# Altium project stmf417 board.PrjPcb (part 3 of 4)

## Sheet RS422.SchDoc
size A3; SheetNumber: 4; SheetTotal: 15
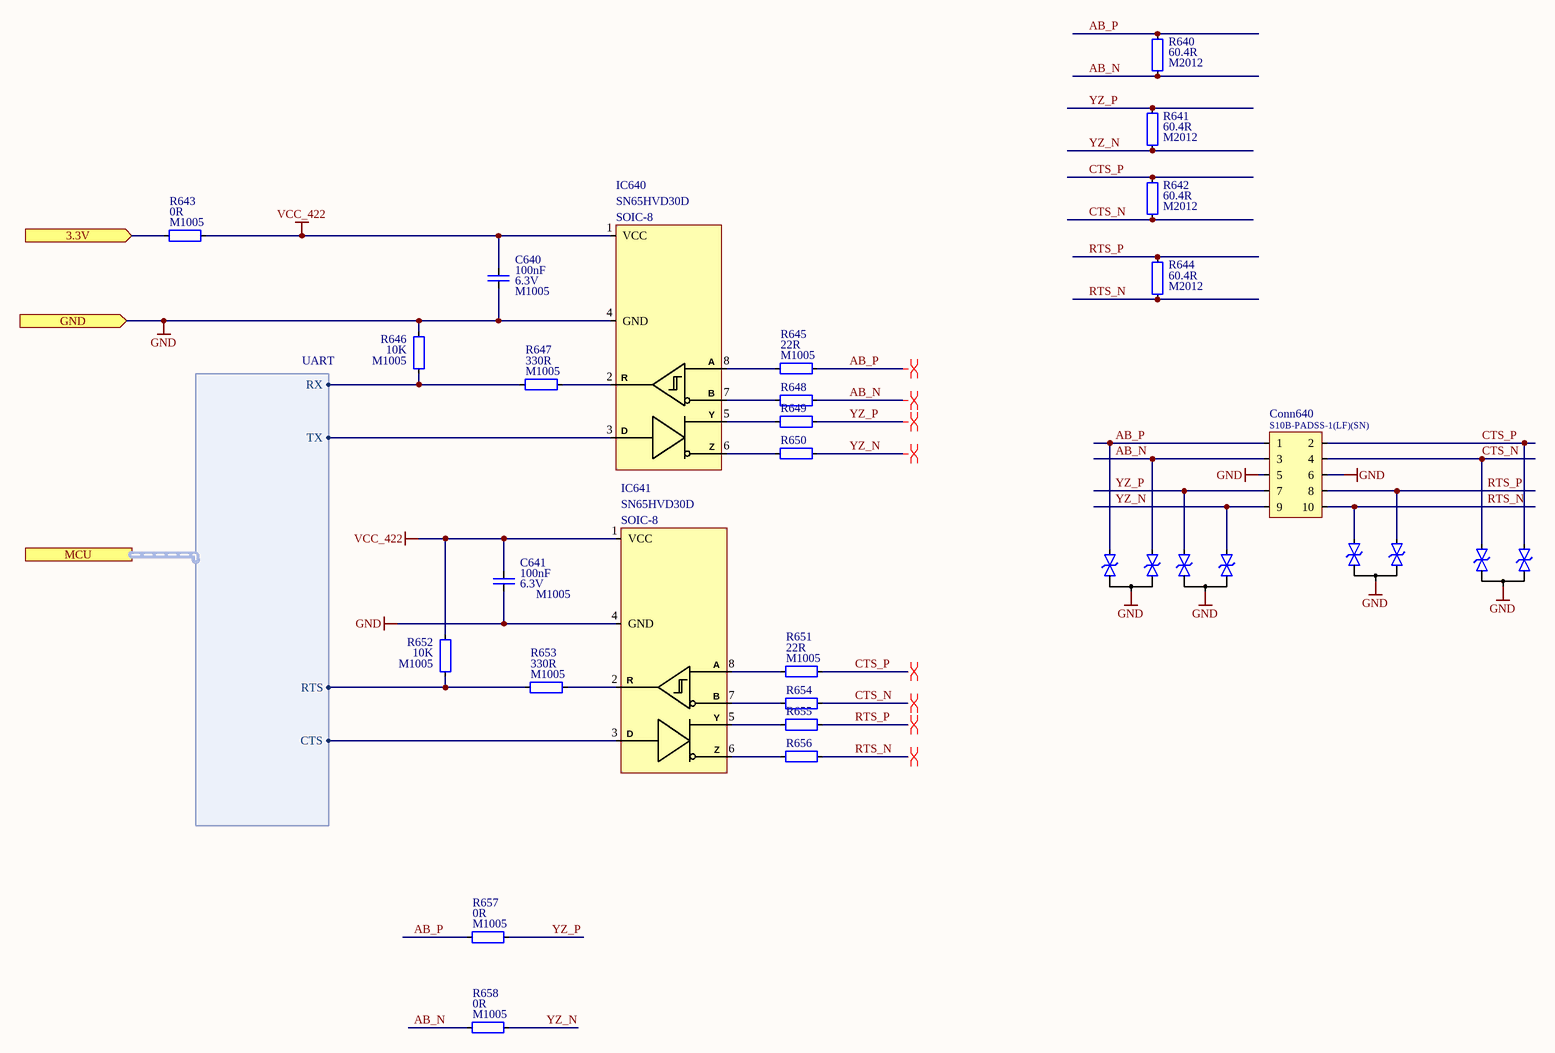
[diagram p7: RS422.SchDoc]

### Parts
C640  value 100nF  Voltage: 6.3V  Package: M1005  [Capacitor_Ceramic_M1005_I0402]  (hidden comment: Capacitor_Ceramic)
C641  value 100nF  Voltage: 6.3V  Package: M1005  [Capacitor_Ceramic_M1005_I0402]  (hidden comment: Capacitor_Ceramic)
Conn640  Manufacturer Part Number: S10B-PADSS-1(LF)(SN)  [Connector, S10B-PADSS-1]  (hidden comment: Connector - 10P)
IC640  Manufacturer Part Number: SN65HVD30D  Package: SOIC-8  [SOIC-8, NB]  (hidden comment: RS422 - Texas, SN65HVD30D)
IC641  Manufacturer Part Number: SN65HVD30D  Package: SOIC-8  [SOIC-8, NB]  (hidden comment: RS422 - Texas, SN65HVD30D)
R640  value 60.4R  Package: M2012  [Resistor_Smd_M2012_I0805]  (hidden comment: Resistor)
R641  value 60.4R  Package: M2012  [Resistor_Smd_M2012_I0805]  (hidden comment: Resistor)
R642  value 60.4R  Package: M2012  [Resistor_Smd_M2012_I0805]  (hidden comment: Resistor)
R643  value 0R  Package: M1005  [Resistor_Smd_M1005_I0402]  (hidden comment: Resistor)
R644  value 60.4R  Package: M2012  [Resistor_Smd_M2012_I0805]  (hidden comment: Resistor)
R645  value 22R  Package: M1005  [Resistor_Smd_M1005_I0402]  (hidden comment: Resistor)
R646  value 10K  Package: M1005  [Resistor_Smd_M1005_I0402]  (hidden comment: Resistor)
R647  value 330R  Package: M1005  [Resistor_Smd_M1005_I0402]  (hidden comment: Resistor)
R648  Resistor  [Resistor_Smd_M1005_I0402]  (value not drawn)
R649  Resistor  [Resistor_Smd_M1005_I0402]  (value not drawn)
R650  Resistor  [Resistor_Smd_M1005_I0402]  (value not drawn)
R651  value 22R  Package: M1005  [Resistor_Smd_M1005_I0402]  (hidden comment: Resistor)
R652  value 10K  Package: M1005  [Resistor_Smd_M1005_I0402]  (hidden comment: Resistor)
R653  value 330R  Package: M1005  [Resistor_Smd_M1005_I0402]  (hidden comment: Resistor)
R654  Resistor  [Resistor_Smd_M1005_I0402]  (value not drawn)
R655  Resistor  [Resistor_Smd_M1005_I0402]  (value not drawn)
R656  Resistor  [Resistor_Smd_M1005_I0402]  (value not drawn)
R657  value 0R  Package: M1005  [Resistor_Smd_M1005_I0402]  (hidden comment: Resistor)
R658  value 0R  Package: M1005  [Resistor_Smd_M1005_I0402]  (hidden comment: Resistor)
TVS640  Diode_Tvs_2P_Bidirectional  [Diode_SOT-23-3_2P_Bidirectional_Type_1]  (value not drawn)
TVS641  Diode_Tvs_2P_Bidirectional  [Diode_SOT-23-3_2P_Bidirectional_Type_1]  (value not drawn)
TVS642  Diode_Tvs_2P_Bidirectional  [Diode_SOT-23-3_2P_Bidirectional_Type_1]  (value not drawn)
TVS643  Diode_Tvs_2P_Bidirectional  [Diode_SOT-23-3_2P_Bidirectional_Type_1]  (value not drawn)

### Ports
3.3V (in), GND (in), MCU (harness UART)

### Harnesses
UART: RX, TX, RTS, CTS

### Nets
3.3V: R643.1 ; port 3.3V
GND: C640.2 C641.2 Conn640.5 Conn640.6 IC640.4(GND) IC641.4(GND) R646.1 TVS640.Common TVS641.Common TVS642.Common TVS643.Common ; port GND
VCC_422: C640.1 C641.1 IC640.1(VCC) IC641.1(VCC) R643.2 R652.1
AB_N: Conn640.3 R640.2 R648.2 R658.1 TVS642.D2
AB_P: Conn640.1 R640.1 R645.2 R657.1 TVS642.D1
CTS_N: Conn640.4 R642.2 R654.2 TVS641.D1
CTS_P: Conn640.2 R642.1 R651.2 TVS641.D2
PA9: IC640.3(D) ; port MCU.TX
PA10: R646.2 R647.1 ; port MCU.RX
PA11: IC641.3(D) ; port MCU.CTS
PA12: R652.2 R653.1 ; port MCU.RTS
RTS_N: Conn640.10 R644.2 R656.2 TVS640.D1
RTS_P: Conn640.8 R644.1 R655.2 TVS640.D2
YZ_N: Conn640.9 R641.2 R650.2 R658.2 TVS643.D2
YZ_P: Conn640.7 R641.1 R649.2 R657.2 TVS643.D1
NetIC640_2: IC640.2(R) R647.2
NetIC640_5: IC640.5(Y) R649.1
NetIC640_6: IC640.6(Z) R650.1
NetIC640_7: IC640.7(B) R648.1
NetIC640_8: IC640.8(A) R645.1
NetIC641_2: IC641.2(R) R653.2
NetIC641_5: IC641.5(Y) R655.1
NetIC641_6: IC641.6(Z) R656.1
NetIC641_7: IC641.7(B) R654.1
NetIC641_8: IC641.8(A) R651.1

### Layout directives
differential pair: AB_N, AB_P, CTS_N, CTS_P, RTS_N, RTS_P, YZ_N, YZ_P

### Library data of the parts
C640 C641 = Capacitor_Ceramic: as C600 on sheet CAN; ComponentLink1Description: Datasheet; ComponentLink1URL: E:\Altium\Datasheets\Capacitor\Kyocera - X5R.pdf; ComponentLink2Description: Supplier Link; ComponentLink2URL: https://www.digikey.com/en/products/detail/kyocera-avx/04026D104KAT4A/8107673; Supplier: Digikey; Supplier Part Number: 478-11504-1-ND; Operating Temperature, Min: +85℃; Operating Temperature, Max: -55℃; Quantity, Min: 1; Quantity, Max: 250000; Price, Min: 0.1; Supplier Currency: $; Price, Max: 0.00189; Supplier Link: https://www.digikey.com/en/products/detail/kyocera-avx/04026D104KAT4A/8107673; Component Type: Ceramic; Component Category: Capacitor
Conn640 = Connector - 10P: Conn, JST, 10P, TH, PAD, Side Entry; ComponentLink1Description: Datasheet; ComponentLink1URL: E:\Altium\Datasheets\Connector - JST\PAD Family.pdf; ComponentLink2Description: Supplier Link; ComponentLink2URL: https://www.digikey.com/en/products/detail/jst-sales-america-inc/S10B-PADSS-1-LF-SN/1634773; Supplier: Digikey; Supplier Part Number: 455-2032-ND; Manufacturer: JST; Operating Temperature, Min: -25℃; Operating Temperature, Max: +85℃; Quantity, Min: 1; Quantity, Max: 10080; Price, Min: 0.65; Supplier Currency: $; Price, Max: 0.27565; Supplier Link: https://www.digikey.com/en/products/detail/jst-sales-america-inc/S10B-PADSS-1-LF-SN/1634773; Component Type: PCB; Component Category: Connector; Package: TH, 2 Rows, RA, Side Entry
IC640 IC641 = RS422 - Texas, SN65HVD30D: IC, Interface, RS422, SOIC-8; ComponentLink1Description: Datasheet; ComponentLink1URL: E:\Altium\Datasheets\IC - Interface\RS422 - Texas, SN65HVD3x.pdf; ComponentLink2Description: Supplier Link; ComponentLink2URL: https://www.digikey.com/en/products/detail/texas-instruments/SN65HVD30D/1574539; Supplier: Digikey; Supplier Part Number: 296-26346-5-ND; Manufacturer: Texas; Operating Temperature, Min: -55℃; Operating Temperature, Max: +85℃; Quantity, Min: 1; Quantity, Max: 1000; Price, Min: 5.44; Supplier Currency: $; Price, Max: 3.1008; Supplier Link: https://www.digikey.com/en/products/detail/texas-instruments/SN65HVD30D/1574539; Component Type: Interface; Component Category: IC
R640-R642 R644 = Resistor: Res, 60.4R, 1%, M1005; Manufacturer: Yageo; Manufacturer Part Number: RC0805FR-0760R4L; Component Category: Resistor; Component Type: Fixed Value; Tolerance: 1%; Supplier Link: https://www.digikey.com/en/products/detail/yageo/RC0805FR-0760R4L/728073; Supplier Currency: $; Price, Max: 0.00328; Price, Min: 0.1; Quantity, Max: 125000; Quantity, Min: 1; Operating Temperature, Max: -55℃; Operating Temperature, Min: +155℃; Supplier Part Number: 311-60.4CRCT-ND; Supplier: Digikey; ComponentLink1Description: Datasheet; ComponentLink1URL: E:\Altium\Datasheets\Resistor\Yageo - RC_L Series.pdf; ComponentLink2Description: Supplier Link; ComponentLink2URL: https://www.digikey.com/en/products/detail/yageo/RC0805FR-0760R4L/728073
R643 R657 R658 = Resistor: as R600 on sheet CAN; Component Category: Resistor; Component Type: Fixed Value; Tolerance: *; Supplier Link: https://www.digikey.com/en/products/detail/yageo/RC0402FR-070RL/2827570; Supplier Currency: $; Price, Max: 0.00109; Price, Min: 0.1; Quantity, Max: 50000; Quantity, Min: 1; Operating Temperature, Max: -55℃; Operating Temperature, Min: +155℃; Supplier Part Number: 311-0.0LRCT-ND; Supplier: Digikey; ComponentLink1Description: Datasheet; ComponentLink1URL: E:\Altium\Datasheets\Resistor\Yageo - RC_L Series.pdf; ComponentLink2Description: Supplier Link; ComponentLink2URL: https://www.digikey.com/en/products/detail/yageo/RC0402FR-070RL/2827570
R645 R648-R651 R654-R656 = Resistor: Res, 22R, 1%, M1005; Manufacturer: Yageo; Manufacturer Part Number: RC0402FR-0722RL; Component Category: Resistor; Component Type: Fixed Value; Tolerance: 1%; Supplier Link: https://www.digikey.com/en/products/detail/yageo/RC0402FR-0722RL/726562; Supplier Currency: $; Price, Max: 0.00129; Price, Min: 0.1; Quantity, Max: 100000; Quantity, Min: 1; Operating Temperature, Max: -55℃; Operating Temperature, Min: +155℃; Supplier Part Number: 311-22.0LRCT-ND; Supplier: Digikey; ComponentLink1Description: Datasheet; ComponentLink1URL: E:\Altium\Datasheets\Resistor\Yageo - RC_L Series.pdf; ComponentLink2Description: Supplier Link; ComponentLink2URL: https://www.digikey.com/en/products/detail/yageo/RC0402FR-0722RL/726562
  R648-R650 R654-R656: Value: 22R; Package: M1005
R646 R652 = Resistor: Res, 10K, 1%, M1005; Manufacturer: Yageo; Manufacturer Part Number: RC0402FR-0710KP; Component Category: Resistor; Component Type: Fixed Value; Tolerance: 1%; Supplier Link: https://www.digikey.com/en/products/detail/yageo/RC0402FR-0710KP/4935264; Supplier Currency: $; Price, Max: 0.00282; Price, Min: 0.1; Quantity, Max: 100000; Quantity, Min: 1; Operating Temperature, Max: -55℃; Operating Temperature, Min: +155℃; Supplier Part Number: YAG1249CT-ND; Supplier: Digikey; ComponentLink1Description: Datasheet; ComponentLink1URL: E:\Altium\Datasheets\Resistor\Yageo - RC_L Series.pdf; ComponentLink2Description: Supplier Link; ComponentLink2URL: https://www.digikey.com/en/products/detail/yageo/RC0402FR-0710KP/4935264
R647 R653 = Resistor: as R621 on sheet RS232; Component Category: Resistor; Component Type: Fixed Value; Tolerance: 1%; Supplier Link: https://www.digikey.com/en/products/detail/yageo/RC0402FR-07330RL/726594; Supplier Currency: $; Price, Max: 0.00129; Price, Min: 0.1; Quantity, Max: 100000; Quantity, Min: 1; Operating Temperature, Max: -55℃; Operating Temperature, Min: +155℃; Supplier Part Number: 311-330LRCT-ND; Supplier: Digikey; ComponentLink1Description: Datasheet; ComponentLink1URL: E:\Altium\Datasheets\Resistor\Yageo - RC_L Series.pdf; ComponentLink2Description: Supplier Link; ComponentLink2URL: https://www.digikey.com/en/products/detail/yageo/RC0402FR-07330RL/726594
TVS640-TVS643 = Diode_Tvs_2P_Bidirectional: TVS, 2P, Bidirectional, 7V/12V, SOT-23-3; Manufacturer Part Number: CDSOT23-SM712; Manufacturer: Bourns; Component Category: Diode; Voltage, Break Down: 7.5V...13.3V; Voltage, Stand Off: 7V...12V; ComponentLink1Description: Datasheet; ComponentLink1URL: E:\Altium\Datasheets\Diode\Bourns, CDSOT23-SM712.pdf; ComponentLink2Description: Supplier Link; ComponentLink2URL: https://www.digikey.com/en/products/detail/bourns-inc/CDSOT23-SM712/1630592; Supplier: Digikey; Supplier Part Number: CDSOT23-SM712CT-ND; Operating Temperature, Min: -55℃; Operating Temperature, Max: +150℃; Quantity, Min: 1; Quantity, Max: 3000; Price, Min: 1.59; Price, Max: 0.675; Supplier Currency: $; Supplier Link: https://www.digikey.com/en/products/detail/bourns-inc/CDSOT23-SM712/1630592; Component Type: TVS; Package: SOT-23-3

## Sheet FTDI.SchDoc
size A3; SheetNumber: 8; SheetTotal: 15
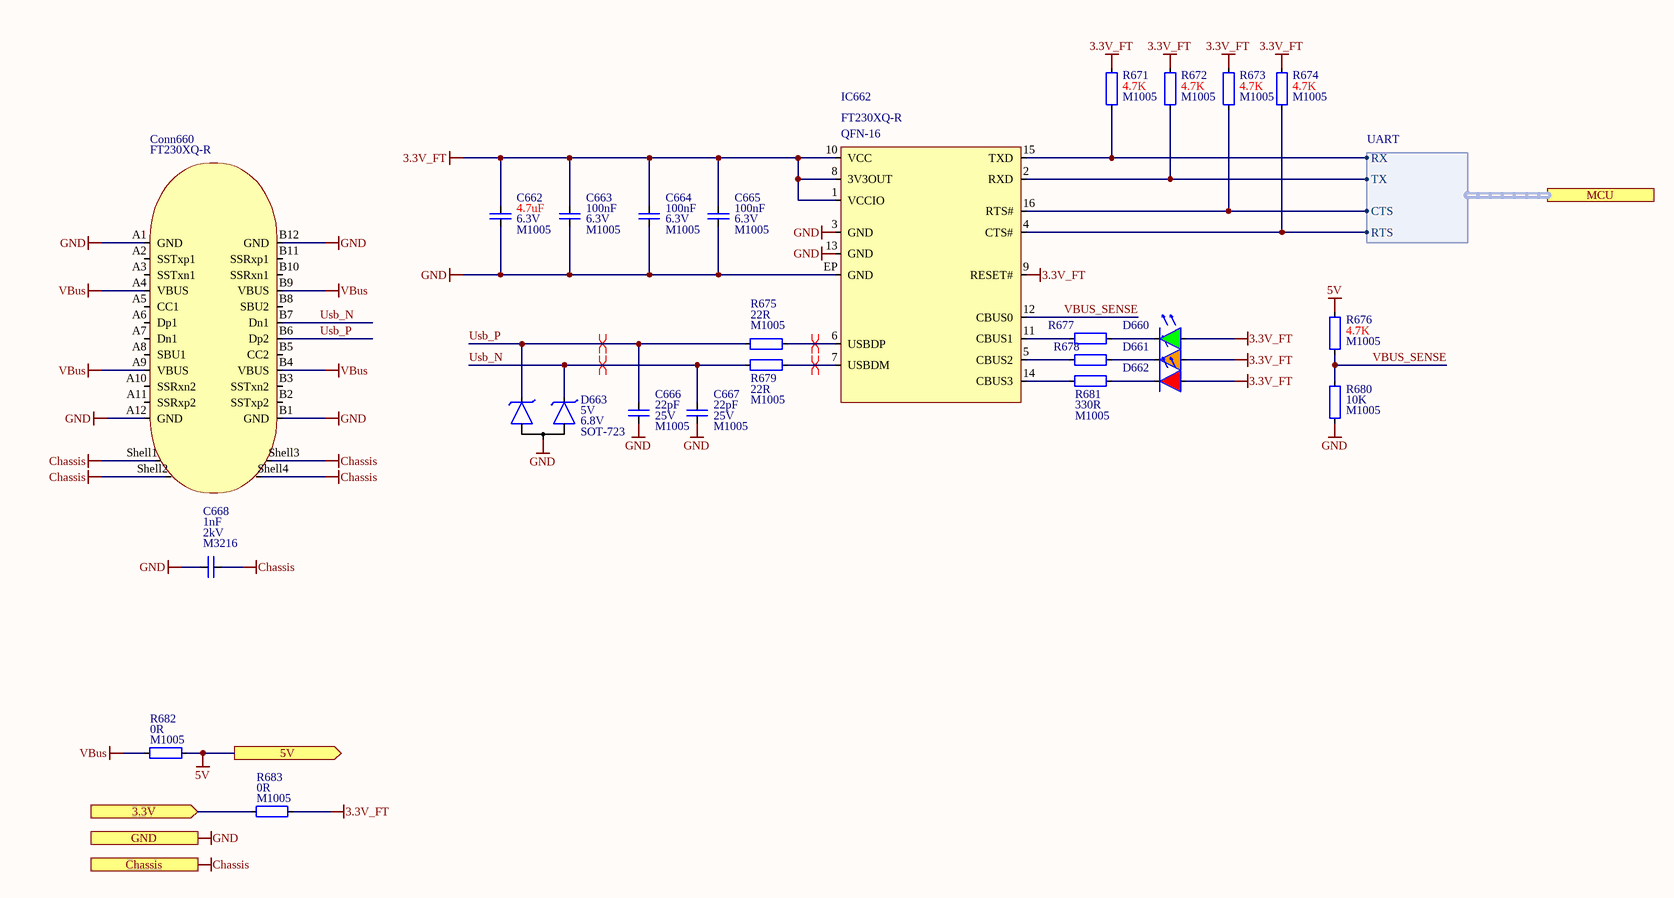
[diagram p8: FTDI.SchDoc]

### Parts
C662  value 4.7uF  Voltage: 6.3V  Package: M1005  [Capacitor_Ceramic_M1005_I0402]  (hidden comment: Capacitor_Ceramic)
C663  value 100nF  Voltage: 6.3V  Package: M1005  [Capacitor_Ceramic_M1005_I0402]  (hidden comment: Capacitor_Ceramic)
C664  value 100nF  Voltage: 6.3V  Package: M1005  [Capacitor_Ceramic_M1005_I0402]  (hidden comment: Capacitor_Ceramic)
C665  value 100nF  Voltage: 6.3V  Package: M1005  [Capacitor_Ceramic_M1005_I0402]  (hidden comment: Capacitor_Ceramic)
C666  value 22pF  Voltage: 25V  Package: M1005  [Capacitor_Ceramic_M1005_I0402]  (hidden comment: Capacitor_Ceramic)
C667  value 22pF  Voltage: 25V  Package: M1005  [Capacitor_Ceramic_M1005_I0402]  (hidden comment: Capacitor_Ceramic)
C668  value 1nF  Voltage: 2kV  Package: M3216  [Capacitor_Ceramic_M3216_I1206]  (hidden comment: Capacitor_Ceramic)
Conn660  Manufacturer Part number: FT230XQ-R  [GCT, USB4056]  (hidden comment: GCT, USB4056)
D660  Diode_Led  [Diode_Smd_M1608_I0603_Green-Yellow]  (value not drawn)
D661  Diode_Led  [Diode_Smd_M1608_I0603_Orange1]  (value not drawn)
D662  Diode_Led  [Diode_Smd_M1608_I0603_Red]  (value not drawn)
D663  Voltage, Break Down: 6.8V  Voltage, Stand Off: 5V  Package: SOT-723  [Diode_SOT-723_2P_Common_Anode_Type_1]  (hidden comment: Diode_Tvs_2P_Common_Anode)
IC662  Manufacturer Part number: FT230XQ-R  Package: QFN-16  [QFN-16, 4mm x 4mm, 0.65mm]  (hidden comment: FTDI_FT230XQ)
R671  value 4.7K  Package: M1005  [Resistor_Smd_M1005_I0402]  (hidden comment: Resistor)
R672  value 4.7K  Package: M1005  [Resistor_Smd_M1005_I0402]  (hidden comment: Resistor)
R673  value 4.7K  Package: M1005  [Resistor_Smd_M1005_I0402]  (hidden comment: Resistor)
R674  value 4.7K  Package: M1005  [Resistor_Smd_M1005_I0402]  (hidden comment: Resistor)
R675  value 22R  Package: M1005  [Resistor_Smd_M1005_I0402]  (hidden comment: Resistor)
R676  value 4.7K  Package: M1005  [Resistor_Smd_M1005_I0402]  (hidden comment: Resistor)
R677  Resistor  [Resistor_Smd_M1005_I0402]  (value not drawn)
R678  Resistor  [Resistor_Smd_M1005_I0402]  (value not drawn)
R679  value 22R  Package: M1005  [Resistor_Smd_M1005_I0402]  (hidden comment: Resistor)
R680  value 10K  Package: M1005  [Resistor_Smd_M1005_I0402]  (hidden comment: Resistor)
R681  value 330R  Package: M1005  [Resistor_Smd_M1005_I0402]  (hidden comment: Resistor)
R682  value 0R  Package: M1005  [Resistor_Smd_M1005_I0402]  (hidden comment: Resistor)
R683  value 0R  Package: M1005  [Resistor_Smd_M1005_I0402]  (hidden comment: Resistor)

### Ports
3.3V (in), 5V (out), Chassis (in), GND (in), MCU (harness UART)

### Harnesses
UART: RX, TX, RTS, CTS

### Nets
3.3V: R683.1 ; port 3.3V
3.3V_FT: C662.1 C663.1 C664.1 C665.1 D660.A D661.A D662.A IC662.1(VCCIO) IC662.8(3V3OUT) IC662.9(RESET#) IC662.10(VCC) R671.1 R672.1 R673.1 R674.1 R683.2
5V: R676.1 R682.2 ; port 5V
Chassis: C668.2 Conn660.Shell1(Chassis1) Conn660.Shell2(Chassis2) Conn660.Shell3(Chassis3) Conn660.Shell4(Chassis4) ; port Chassis
GND: C662.2 C663.2 C664.2 C665.2 C666.2 C667.2 C668.1 Conn660.A1(GND) Conn660.A12(GND) Conn660.B1(GND) Conn660.B12(GND) D663.A IC662.3(GND) IC662.13(GND) IC662.EP(GND) R680.2 ; port GND
VBus: Conn660.A4(VBUS) Conn660.A9(VBUS) Conn660.B4(VBUS) Conn660.B9(VBUS) R682.1
PB10: IC662.2(RXD) R672.2 ; port MCU.TX
PB14: IC662.4(CTS#) R674.2 ; port MCU.RTS
PD9: IC662.15(TXD) R671.2 ; port MCU.RX
PD11: IC662.16(RTS#) R673.2 ; port MCU.CTS
Usb_N: C667.1 Conn660.B7(Dn1) D663.C2 R679.1
Usb_P: C666.1 Conn660.B6(Dp2) D663.C1 R675.1
VBUS_SENSE: IC662.12(CBUS0) R676.2 R680.1
NetD660_C: D660.C R677.2
NetD661_C: D661.C R678.2
NetD662_C: D662.C R681.2
NetIC662_5: IC662.5(CBUS2) R678.1
NetIC662_6: IC662.6(USBDP) R675.2
NetIC662_7: IC662.7(USBDM) R679.2
NetIC662_11: IC662.11(CBUS1) R677.1
NetIC662_14: IC662.14(CBUS3) R681.1

Not connected (* = marked no-connect by the designer): Conn660 A2(SSTxp1) A3(SSTxn1) A5(CC1) A6(Dp1) A7(Dn1) A8(SBU1) A10(SSRxn2) A11(SSRxp2) B2(SSTxp2) B3(SSTxn2) B5(CC2) B8(SBU2) B10(SSRxn1) B11(SSRxp1)

### Layout directives
differential pair: NetIC662_6, NetIC662_7, Usb_N, Usb_P

### Library data of the parts
C662-C665 = Capacitor_Ceramic: as C600 on sheet CAN; ComponentLink1Description: Datasheet; ComponentLink1URL: E:\Altium\Datasheets\Capacitor\Kyocera - X5R.pdf; ComponentLink2Description: Supplier Link; ComponentLink2URL: https://www.digikey.com/en/products/detail/kyocera-avx/04026D104KAT4A/8107673; Supplier: Digikey; Supplier Part Number: 478-11504-1-ND; Operating Temperature, Min: +85℃; Operating Temperature, Max: -55℃; Quantity, Min: 1; Quantity, Max: 250000; Price, Min: 0.1; Supplier Currency: $; Price, Max: 0.00189; Supplier Link: https://www.digikey.com/en/products/detail/kyocera-avx/04026D104KAT4A/8107673; Component Type: Ceramic; Component Category: Capacitor
C666 C667 = Capacitor_Ceramic: Cap, Cer, 22pF, 25V, M1005; Manufacturer Part Number: 0402N220J250CT; Manufacturer: Walsin; Temperature Coefficient: C0G, NP0; Tolerance: 5%; ComponentLink1Description: Datasheet; ComponentLink1URL: E:\Altium\Datasheets\Capacitor\Walsin - Multilayer Ceramic Capacitors.pdf; ComponentLink2Description: Supplier Link; ComponentLink2URL: https://www.digikey.com/en/products/detail/walsin-technology-corporation/0402N220J250CT/9354779; Supplier: Digikey; Supplier Part Number: 1292-1282-1-ND; Operating Temperature, Min: +125℃; Operating Temperature, Max: -55℃; Quantity, Min: 1; Quantity, Max: 250000; Price, Min: 0.1; Supplier Currency: $; Price, Max: 0.00177; Supplier Link: https://www.digikey.com/en/products/detail/walsin-technology-corporation/0402N220J250CT/9354779; Component Type: Ceramic; Component Category: Capacitor
C668 = Capacitor_Ceramic: Cap, Cer, 1nF, 2kV, M3216; Manufacturer Part Number: CC1206MKX7RDBB102; Manufacturer: Yageo; Temperature Coefficient: X7R; Tolerance: 20%; ComponentLink1Description: Datasheet; ComponentLink1URL: E:\Altium\Datasheets\Capacitor\Yageo - Surface-Mount Ceramic Multilayer Capacitors.pdf; ComponentLink2Description: Supplier Link; ComponentLink2URL: https://www.digikey.com/en/products/detail/yageo/CC1206MKX7RDBB102/5884663; Supplier: Digikey; Supplier Part Number: 311-4501-1-ND; Operating Temperature, Min: +125℃; Operating Temperature, Max: -55℃; Quantity, Min: 1; Quantity, Max: 300000; Price, Min: 0.23; Supplier Currency: $; Price, Max: 0.03271; Supplier Link: https://www.digikey.com/en/products/detail/yageo/CC1206MKX7RDBB102/5884663; Component Type: Ceramic; Component Category: Capacitor
Conn660 = GCT, USB4056: IC,Interface,FTDI,QFN16; component category: capacitor*; ComponentLink1Description: datasheet; ComponentLink1URL: *; ComponentLink2Description: supplier link; ComponentLink2URL: *; component type: ceramic; supplier link: *; supplier currency: *; price,max: *; price,min: *; Quantity,max: *; Quantity,min: *; Operating Temparature,max: +85; Operating Temparature,min: -40; Supplier Part number: *; Supplier: Digikey; Manufacturer: FTDI; Package: SOP-8
D660 = Diode_Led: as D101 on sheet Power; ComponentLink1Description: Datasheet; ComponentLink1URL: E:\Altium\Datasheets\Diode\Rohm, SML-D12x1 Series.pdf; ComponentLink2Description: Supplier Link; ComponentLink2URL: https://www.digikey.com/en/products/detail/rohm-semiconductor/SML-D12M1WT86/5843856; Supplier: Digikey; Supplier Part Number: SML-D12M1WT86CT-ND; Operating Temperature, Min: -40℃; Operating Temperature, Max: +85℃; Quantity, Min: 1; Quantity, Max: 75000; Price, Min: 0.25; Price, Max: 0.02838; Supplier Currency: $; Supplier Link: https://www.digikey.com/en/products/detail/rohm-semiconductor/SML-D12M1WT86/5843856; Component Type: Led; Component Category: Diode; Current: 20mA; Voltage: 2.2V; Package: M1608
D661 = Diode_Led: as D740 on sheet Ethernet; ComponentLink1Description: Datasheet; ComponentLink1URL: E:\Altium\Datasheets\Diode\Rohm, SML-D12x1 Series.pdf; ComponentLink2Description: Supplier Link; ComponentLink2URL: https://www.digikey.com/en/products/detail/rohm-semiconductor/SML-D12D1WT86/5843854; Supplier: Digikey; Supplier Part Number: SML-D12D1WT86CT-ND; Operating Temperature, Min: -40℃; Operating Temperature, Max: +85℃; Quantity, Min: 1; Quantity, Max: 75000; Price, Min: 0.25; Price, Max: 0.02838; Supplier Currency: $; Supplier Link: https://www.digikey.com/en/products/detail/rohm-semiconductor/SML-D12D1WT86/5843854; Component Type: Led; Component Category: Diode; Current: 20mA; Voltage: 2.2V; Package: M1608
D662 = Diode_Led: Diode, Led, Red, 2.2V, 20mA, M1608; Manufacturer Part Number: SML-D12U1WT86; Manufacturer: Rohm; ComponentLink1Description: Datasheet; ComponentLink1URL: E:\Altium\Datasheets\Diode\Rohm, SML-D12x1 Series.pdf; ComponentLink2Description: Supplier Link; ComponentLink2URL: https://www.digikey.com/en/products/detail/rohm-semiconductor/SML-D12U1WT86/5843853; Supplier: Digikey; Supplier Part Number: SML-D12U1WT86CT-ND; Operating Temperature, Min: -40℃; Operating Temperature, Max: +85℃; Quantity, Min: 1; Quantity, Max: 75000; Price, Min: 0.25; Price, Max: 0.02838; Supplier Currency: $; Supplier Link: https://www.digikey.com/en/products/detail/rohm-semiconductor/SML-D12U1WT86/5843853; Component Type: Led; Component Category: Diode; Current: 20mA; Voltage: 2.2V; Package: M1608
D663 = Diode_Tvs_2P_Common_Anode: Diode, TVS, 5V/6.8V, SOD-723; Manufacturer Part Number: DF3A6.8LFV,L3F; Manufacturer: Toshiba; ComponentLink1Description: Datasheet; ComponentLink1URL: E:\Altium\Datasheets\Diode\Toshiba, DF3A6.8LFV.pdf; ComponentLink2Description: Supplier Link; ComponentLink2URL: https://www.digikey.com/en/products/detail/toshiba-semiconductor-and-storage/DF3A6-8LFV-L3F/4305070; Supplier: Digikey; Supplier Part Number: DF3A6.8LFVL3FCT-ND; Operating Temperature, Min: ---℃; Operating Temperature, Max: ---℃; Quantity, Min: 1; Quantity, Max: 200000; Price, Min: 0.25; Price, Max: 0.027; Supplier Currency: $; Supplier Link: https://www.digikey.com/en/products/detail/toshiba-semiconductor-and-storage/DF3A6-8LFV-L3F/4305070; Component Type: Tvs; Component Category: Diode
IC662 = FTDI_FT230XQ: IC,Interface,FTDI,QFN16; component category: capacitor*; ComponentLink1Description: datasheet; ComponentLink1URL: *; ComponentLink2Description: supplier link; ComponentLink2URL: *; component type: ceramic; supplier link: *; supplier currency: *; price,max: *; price,min: *; Quantity,max: *; Quantity,min: *; Operating Temparature,max: +85; Operating Temparature,min: -40; Supplier Part number: *; Supplier: Digikey; Manufacturer: FTDI
R671-R674 R676 R680 = Resistor: as R646 on sheet RS422; Component Category: Resistor; Component Type: Fixed Value; Tolerance: 1%; Supplier Link: https://www.digikey.com/en/products/detail/yageo/RC0402FR-0710KP/4935264; Supplier Currency: $; Price, Max: 0.00282; Price, Min: 0.1; Quantity, Max: 100000; Quantity, Min: 1; Operating Temperature, Max: -55℃; Operating Temperature, Min: +155℃; Supplier Part Number: YAG1249CT-ND; Supplier: Digikey; ComponentLink1Description: Datasheet; ComponentLink1URL: E:\Altium\Datasheets\Resistor\Yageo - RC_L Series.pdf; ComponentLink2Description: Supplier Link; ComponentLink2URL: https://www.digikey.com/en/products/detail/yageo/RC0402FR-0710KP/4935264
R675 R679 = Resistor: as R645 on sheet RS422; Component Category: Resistor; Component Type: Fixed Value; Tolerance: 1%; Supplier Link: https://www.digikey.com/en/products/detail/yageo/RC0402FR-0722RL/726562; Supplier Currency: $; Price, Max: 0.00129; Price, Min: 0.1; Quantity, Max: 100000; Quantity, Min: 1; Operating Temperature, Max: -55℃; Operating Temperature, Min: +155℃; Supplier Part Number: 311-22.0LRCT-ND; Supplier: Digikey; ComponentLink1Description: Datasheet; ComponentLink1URL: E:\Altium\Datasheets\Resistor\Yageo - RC_L Series.pdf; ComponentLink2Description: Supplier Link; ComponentLink2URL: https://www.digikey.com/en/products/detail/yageo/RC0402FR-0722RL/726562
R677 R678 R681 = Resistor: as R621 on sheet RS232; Component Category: Resistor; Component Type: Fixed Value; Tolerance: 1%; Supplier Link: https://www.digikey.com/en/products/detail/yageo/RC0402FR-07330RL/726594; Supplier Currency: $; Price, Max: 0.00129; Price, Min: 0.1; Quantity, Max: 100000; Quantity, Min: 1; Operating Temperature, Max: -55℃; Operating Temperature, Min: +155℃; Supplier Part Number: 311-330LRCT-ND; Supplier: Digikey; ComponentLink1Description: Datasheet; ComponentLink1URL: E:\Altium\Datasheets\Resistor\Yageo - RC_L Series.pdf; ComponentLink2Description: Supplier Link; ComponentLink2URL: https://www.digikey.com/en/products/detail/yageo/RC0402FR-07330RL/726594
  R677 R678: Value: 330R; Package: M1005
R682 R683 = Resistor: as R600 on sheet CAN; Component Category: Resistor; Component Type: Fixed Value; Tolerance: *; Supplier Link: https://www.digikey.com/en/products/detail/yageo/RC0402FR-070RL/2827570; Supplier Currency: $; Price, Max: 0.00109; Price, Min: 0.1; Quantity, Max: 50000; Quantity, Min: 1; Operating Temperature, Max: -55℃; Operating Temperature, Min: +155℃; Supplier Part Number: 311-0.0LRCT-ND; Supplier: Digikey; ComponentLink1Description: Datasheet; ComponentLink1URL: E:\Altium\Datasheets\Resistor\Yageo - RC_L Series.pdf; ComponentLink2Description: Supplier Link; ComponentLink2URL: https://www.digikey.com/en/products/detail/yageo/RC0402FR-070RL/2827570

## Sheet GPIO.SchDoc
size A3; SheetNumber: 9; SheetTotal: 15
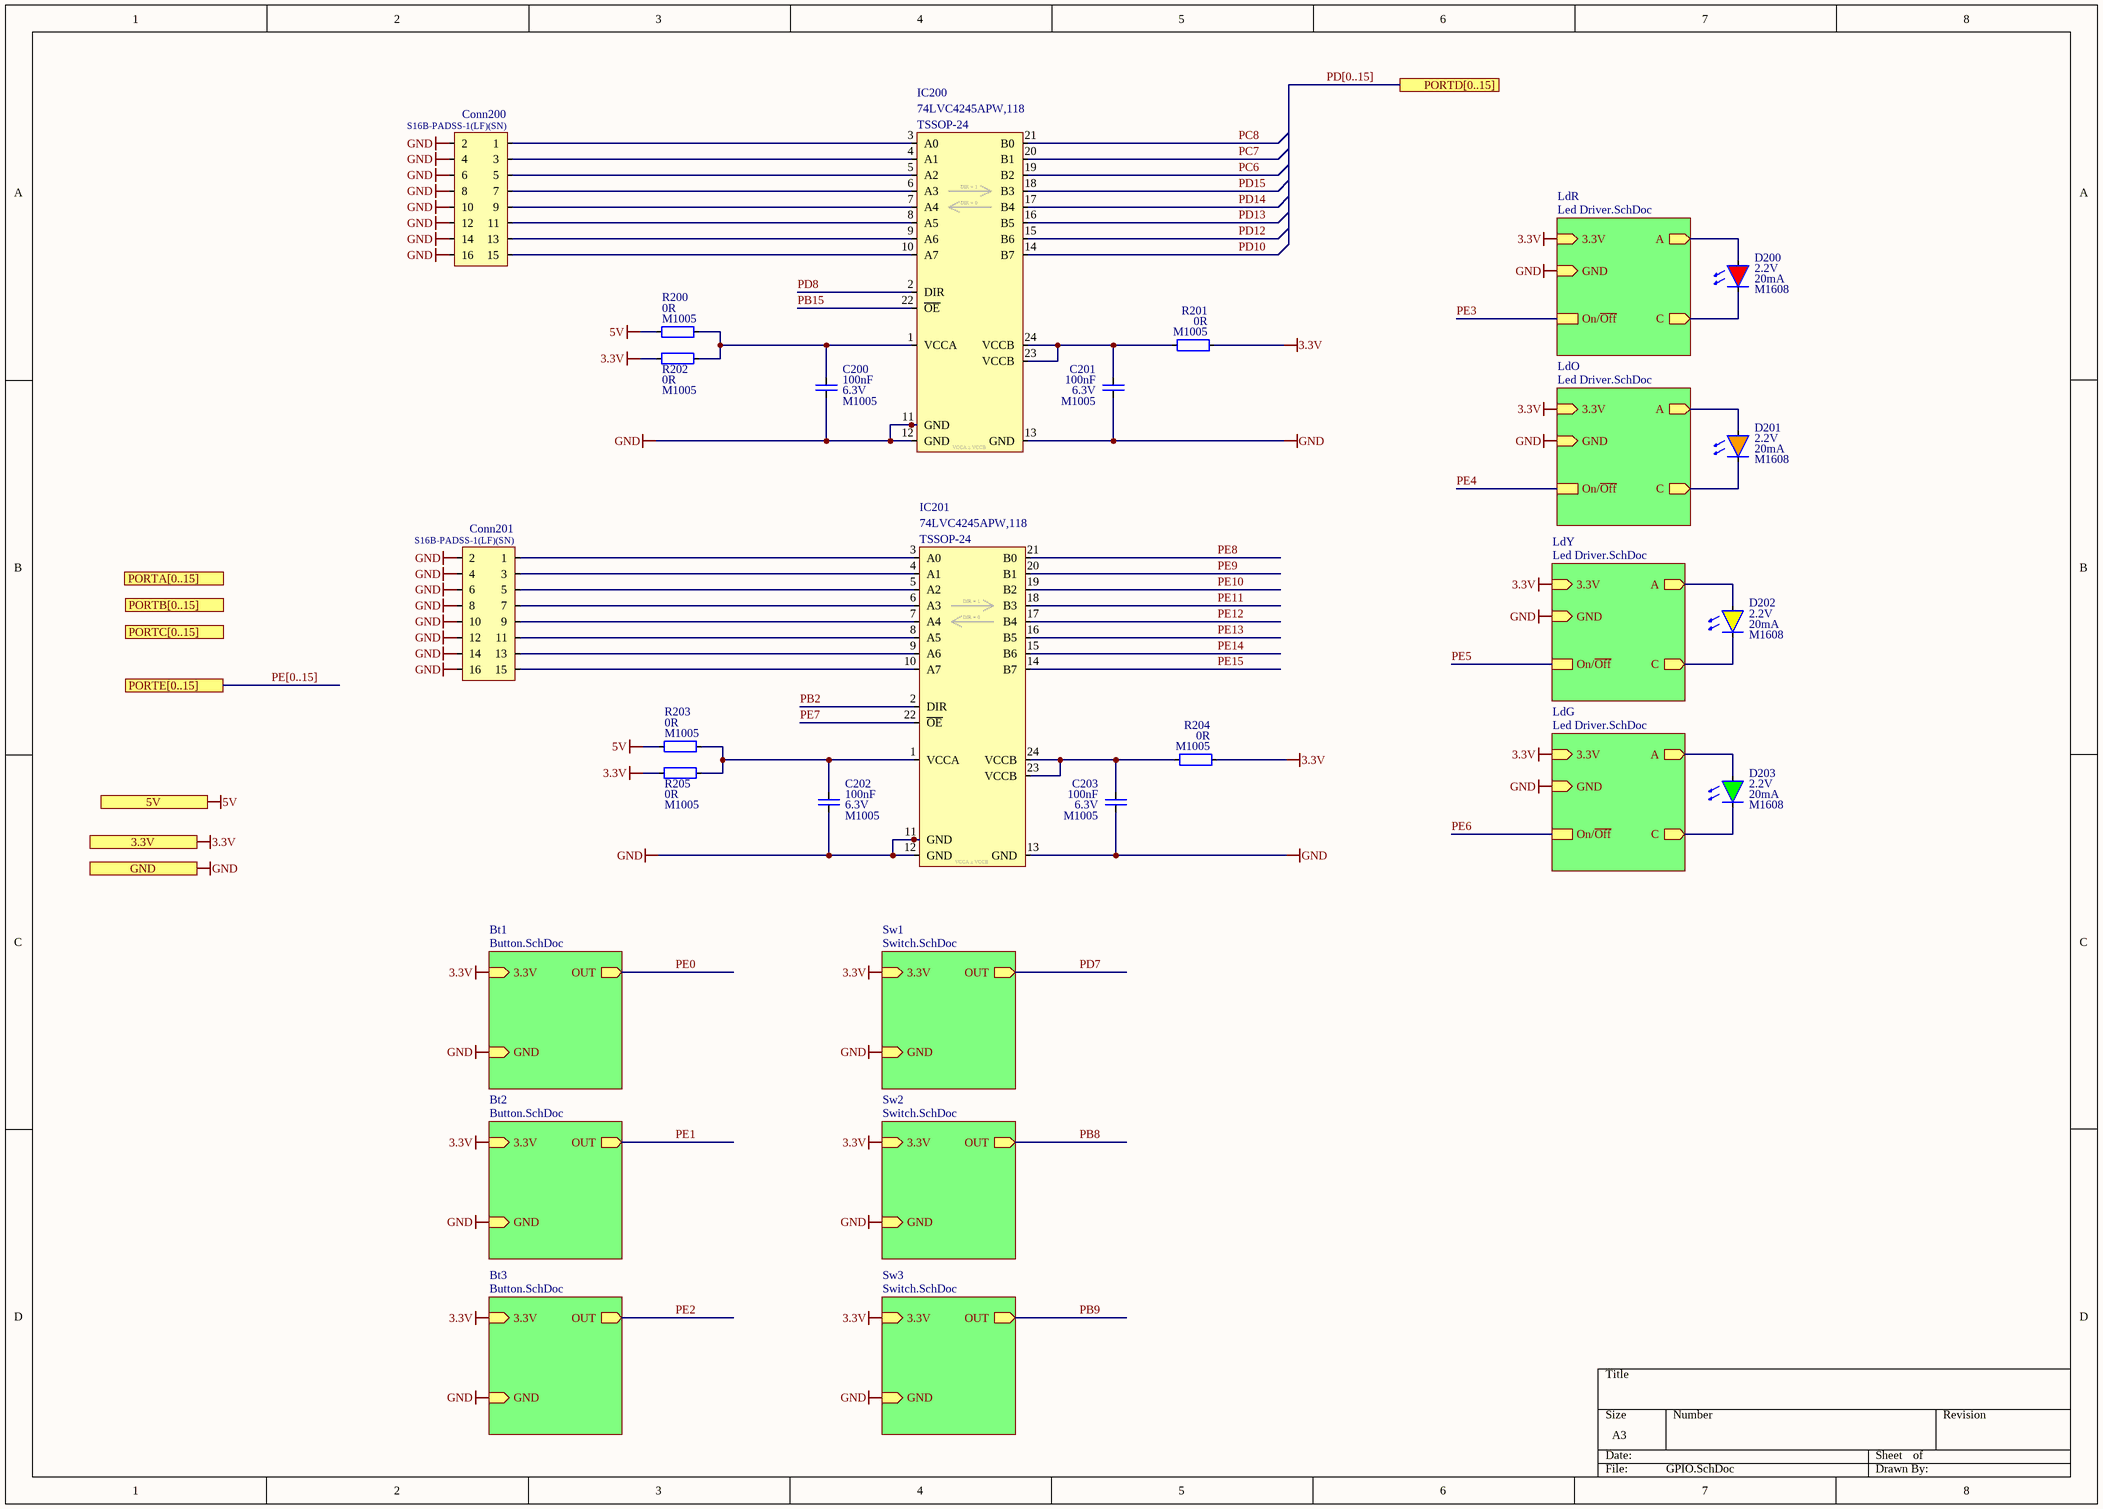
[diagram p9: GPIO.SchDoc]

### Parts
C200  value 100nF  Voltage: 6.3V  Package: M1005  [Capacitor_Ceramic_M1005_I0402]  (hidden comment: Capacitor_Ceramic)
C201  value 100nF  Voltage: 6.3V  Package: M1005  [Capacitor_Ceramic_M1005_I0402]  (hidden comment: Capacitor_Ceramic)
C202  value 100nF  Voltage: 6.3V  Package: M1005  [Capacitor_Ceramic_M1005_I0402]  (hidden comment: Capacitor_Ceramic)
C203  value 100nF  Voltage: 6.3V  Package: M1005  [Capacitor_Ceramic_M1005_I0402]  (hidden comment: Capacitor_Ceramic)
Conn200  Manufacturer Part Number: S16B-PADSS-1(LF)(SN)  [Connector, S16B-PADSS-1]  (hidden comment: Connector - 16P)
Conn201  Manufacturer Part Number: S16B-PADSS-1(LF)(SN)  [Connector, S16B-PADSS-1]  (hidden comment: Connector - 16P)
D200  Current: 20mA  Voltage: 2.2V  Package: M1608  [Diode_Smd_M1608_I0603_Red]  (hidden comment: Diode_Led)
D201  Current: 20mA  Voltage: 2.2V  Package: M1608  [Diode_Smd_M1608_I0603_Orange1]  (hidden comment: Diode_Led)
D202  Current: 20mA  Voltage: 2.2V  Package: M1608  [Diode_Smd_M1608_I0603_Yellow]  (hidden comment: Diode_Led)
D203  Current: 20mA  Voltage: 2.2V  Package: M1608  [Diode_Smd_M1608_I0603_Green-Yellow]  (hidden comment: Diode_Led)
IC200  Manufacturer Part Number: 74LVC4245APW,118  [TSSOP-24]  (hidden comment: Nexperia, 74LVC4245A)
IC201  Manufacturer Part Number: 74LVC4245APW,118  [TSSOP-24]  (hidden comment: Nexperia, 74LVC4245A)
R200  value 0R  Package: M1005  [Resistor_Smd_M1005_I0402]  (hidden comment: Resistor)
R201  value 0R  Package: M1005  [Resistor_Smd_M1005_I0402]  (hidden comment: Resistor)
R202  value 0R  Package: M1005  [Resistor_Smd_M1005_I0402]  (hidden comment: Resistor)
R203  value 0R  Package: M1005  [Resistor_Smd_M1005_I0402]  (hidden comment: Resistor)
R204  value 0R  Package: M1005  [Resistor_Smd_M1005_I0402]  (hidden comment: Resistor)
R205  value 0R  Package: M1005  [Resistor_Smd_M1005_I0402]  (hidden comment: Resistor)

### Sub-sheets
Bt1 = Button.SchDoc: 3.3V (in), GND (in), OUT (out)
Bt2 = Button.SchDoc: 3.3V (in), GND (in), OUT (out)
Bt3 = Button.SchDoc: 3.3V (in), GND (in), OUT (out)
LdG = Led Driver.SchDoc: 3.3V (in), GND (in), A (out), On/~{Off}, C (out)
LdO = Led Driver.SchDoc: 3.3V (in), GND (in), A (out), On/~{Off}, C (out)
LdR = Led Driver.SchDoc: 3.3V (in), GND (in), A (out), On/~{Off}, C (out)
LdY = Led Driver.SchDoc: 3.3V (in), GND (in), A (out), On/~{Off}, C (out)
Sw1 = Switch.SchDoc: 3.3V (in), GND (in), OUT (out)
Sw2 = Switch.SchDoc: 3.3V (in), GND (in), OUT (out)
Sw3 = Switch.SchDoc: 3.3V (in), GND (in), OUT (out)

### Ports
3.3V (in), 5V (in), GND (in), PORTA[0..15], PORTB[0..15], PORTC[0..15], PORTD[0..15], PORTE[0..15]

### Nets
3.3V: R201.1 R202.1 R204.1 R205.1 ; port 3.3V, sheet Bt1/3.3V, sheet Bt2/3.3V, sheet Bt3/3.3V, sheet Sw1/3.3V, sheet Sw2/3.3V, sheet Sw3/3.3V, sheet LdR/3.3V, sheet LdO/3.3V, sheet LdY/3.3V, sheet LdG/3.3V
5V: R200.1 R203.1 ; port 5V
GND: C200.2 C201.2 C202.2 C203.2 Conn200.2 Conn200.4 Conn200.6 Conn200.8 Conn200.10 Conn200.12 Conn200.14 Conn200.16 Conn201.2 Conn201.4 Conn201.6 Conn201.8 Conn201.10 Conn201.12 Conn201.14 Conn201.16 IC200.11(GND) IC200.12(GND) IC200.13(GND) IC201.11(GND) IC201.12(GND) IC201.13(GND) ; port GND, sheet Bt1/GND, sheet Bt2/GND, sheet Bt3/GND, sheet Sw1/GND, sheet Sw2/GND, sheet Sw3/GND, sheet LdR/GND, sheet LdO/GND, sheet LdY/GND, sheet LdG/GND
A: D200.A ; sheet LdR/A
A: D201.A ; sheet LdO/A  [a separate net that carries the same name]
A: D202.A ; sheet LdY/A  [a separate net that carries the same name]
A: D203.A ; sheet LdG/A  [a separate net that carries the same name]
C: D200.C ; sheet LdR/C
C: D201.C ; sheet LdO/C  [a separate net that carries the same name]
C: D202.C ; sheet LdY/C  [a separate net that carries the same name]
C: D203.C ; sheet LdG/C  [a separate net that carries the same name]
PB2: IC201.2(DIR)
PB15: IC200.22(~{OE})
PC6: IC200.19(B2)
PC7: IC200.20(B1)
PC8: IC200.21(B0)
PD8: IC200.2(DIR)
PD10: IC200.14(B7)
PD12: IC200.15(B6)
PD13: IC200.16(B5)
PD14: IC200.17(B4)
PD15: IC200.18(B3)
PE7: IC201.22(~{OE})
PE8: IC201.21(B0)
PE9: IC201.20(B1)
PE10: IC201.19(B2)
PE11: IC201.18(B3)
PE12: IC201.17(B4)
PE13: IC201.16(B5)
PE14: IC201.15(B6)
PE15: IC201.14(B7)
NetC200_1: C200.1 IC200.1(VCCA) R200.2 R202.2
NetC201_1: C201.1 IC200.23(VCCB) IC200.24(VCCB) R201.2
NetC202_1: C202.1 IC201.1(VCCA) R203.2 R205.2
NetC203_1: C203.1 IC201.23(VCCB) IC201.24(VCCB) R204.2
NetConn200_1: Conn200.1 IC200.3(A0)
NetConn200_3: Conn200.3 IC200.4(A1)
NetConn200_5: Conn200.5 IC200.5(A2)
NetConn200_7: Conn200.7 IC200.6(A3)
NetConn200_9: Conn200.9 IC200.7(A4)
NetConn200_11: Conn200.11 IC200.8(A5)
NetConn200_13: Conn200.13 IC200.9(A6)
NetConn200_15: Conn200.15 IC200.10(A7)
NetConn201_1: Conn201.1 IC201.3(A0)
NetConn201_3: Conn201.3 IC201.4(A1)
NetConn201_5: Conn201.5 IC201.5(A2)
NetConn201_7: Conn201.7 IC201.6(A3)
NetConn201_9: Conn201.9 IC201.7(A4)
NetConn201_11: Conn201.11 IC201.8(A5)
NetConn201_13: Conn201.13 IC201.9(A6)
NetConn201_15: Conn201.15 IC201.10(A7)

### Buses and harness runs
bus PD[0..15] = port PORTD[0..15]
bus PE[0..15] = port PORTE[0..15]

### Notes on the sheet
- (in symbol Nexperia, 74LVC4245A) DIR = 1; DIR = 0; VCCA ≥ VCCB

### Library data of the parts
C200-C203 = Capacitor_Ceramic: Cap, Cer, 100nF, 6.3V, M1005; Manufacturer Part Number: 04026D104KAT4A; Manufacturer: Kyocera; Temperature Coefficient: X5R; Tolerance: 10%; ComponentLink1Description: Datasheet; ComponentLink1URL: E:\Altium\Datasheets\Capacitor\Kyocera - X5R.pdf; ComponentLink2Description: Supplier Link; ComponentLink2URL: https://www.digikey.com/en/products/detail/kyocera-avx/04026D104KAT4A/8107673; Supplier: Digikey; Supplier Part Number: 478-11504-1-ND; Operating Temperature, Min: +85℃; Operating Temperature, Max: -55℃; Quantity, Min: 1; Quantity, Max: 250000; Price, Min: 0.1; Supplier Currency: $; Price, Max: 0.00189; Supplier Link: https://www.digikey.com/en/products/detail/kyocera-avx/04026D104KAT4A/8107673; Component Type: Ceramic; Component Category: Capacitor
Conn200 Conn201 = Connector - 16P: Conn, JST, 16P, TH, PAD, Side Entry; ComponentLink1Description: Datasheet; ComponentLink1URL: E:\Altium\Datasheets\Connector - JST\PAD Family.pdf; ComponentLink2Description: Supplier Link; ComponentLink2URL: https://www.digikey.com/en/products/detail/jst-sales-america-inc/S16B-PADSS-1-LF-SN/1634778; Supplier: Digikey; Supplier Part Number: 455-2037-ND; Manufacturer: JST; Operating Temperature, Min: -25℃; Operating Temperature, Max: +85℃; Quantity, Min: 1; Quantity, Max: 10080; Price, Min: 0.77; Supplier Currency: $; Price, Max: 0.35386; Supplier Link: https://www.digikey.com/en/products/detail/jst-sales-america-inc/S16B-PADSS-1-LF-SN/1634778; Component Type: PCB; Component Category: Connector; Package: TH, 2 Rows, RA, Side Entry
D200 = Diode_Led: Diode, Led, Red, 2.2V, 20mA, M1608; Manufacturer Part Number: SML-D12U1WT86; Manufacturer: Rohm; ComponentLink1Description: Datasheet; ComponentLink1URL: E:\Altium\Datasheets\Diode\Rohm, SML-D12x1 Series.pdf; ComponentLink2Description: Supplier Link; ComponentLink2URL: https://www.digikey.com/en/products/detail/rohm-semiconductor/SML-D12U1WT86/5843853; Supplier: Digikey; Supplier Part Number: SML-D12U1WT86CT-ND; Operating Temperature, Min: -40℃; Operating Temperature, Max: +85℃; Quantity, Min: 1; Quantity, Max: 75000; Price, Min: 0.25; Price, Max: 0.02838; Supplier Currency: $; Supplier Link: https://www.digikey.com/en/products/detail/rohm-semiconductor/SML-D12U1WT86/5843853; Component Type: Led; Component Category: Diode
D201 = Diode_Led: Diode, Led, Orange, 2.2V, 20mA, M1608; Manufacturer Part Number: SML-D12D1WT86; Manufacturer: Rohm; ComponentLink1Description: Datasheet; ComponentLink1URL: E:\Altium\Datasheets\Diode\Rohm, SML-D12x1 Series.pdf; ComponentLink2Description: Supplier Link; ComponentLink2URL: https://www.digikey.com/en/products/detail/rohm-semiconductor/SML-D12D1WT86/5843854; Supplier: Digikey; Supplier Part Number: SML-D12D1WT86CT-ND; Operating Temperature, Min: -40℃; Operating Temperature, Max: +85℃; Quantity, Min: 1; Quantity, Max: 75000; Price, Min: 0.25; Price, Max: 0.02838; Supplier Currency: $; Supplier Link: https://www.digikey.com/en/products/detail/rohm-semiconductor/SML-D12D1WT86/5843854; Component Type: Led; Component Category: Diode
D202 = Diode_Led: Diode, Led, Yellow, 2.2V, 20mA, M1608; Manufacturer Part Number: SML-D12Y1WT86; Manufacturer: Rohm; ComponentLink1Description: Datasheet; ComponentLink1URL: E:\Altium\Datasheets\Diode\Rohm, SML-D12x1 Series.pdf; ComponentLink2Description: Supplier Link; ComponentLink2URL: https://www.digikey.com/en/products/detail/rohm-semiconductor/SML-D12Y1WT86/5843855; Supplier: Digikey; Supplier Part Number: SML-D12Y1WT86CT-ND; Operating Temperature, Min: -40℃; Operating Temperature, Max: +85℃; Quantity, Min: 1; Quantity, Max: 75000; Price, Min: 0.25; Price, Max: 0.02838; Supplier Currency: $; Supplier Link: https://www.digikey.com/en/products/detail/rohm-semiconductor/SML-D12Y1WT86/5843855; Component Type: Led; Component Category: Diode
D203 = Diode_Led: Diode, Led, Green-Yellow, 2.2V, 20mA, M1608; Manufacturer Part Number: SML-D12M1WT86; Manufacturer: Rohm; ComponentLink1Description: Datasheet; ComponentLink1URL: E:\Altium\Datasheets\Diode\Rohm, SML-D12x1 Series.pdf; ComponentLink2Description: Supplier Link; ComponentLink2URL: https://www.digikey.com/en/products/detail/rohm-semiconductor/SML-D12M1WT86/5843856; Supplier: Digikey; Supplier Part Number: SML-D12M1WT86CT-ND; Operating Temperature, Min: -40℃; Operating Temperature, Max: +85℃; Quantity, Min: 1; Quantity, Max: 75000; Price, Min: 0.25; Price, Max: 0.02838; Supplier Currency: $; Supplier Link: https://www.digikey.com/en/products/detail/rohm-semiconductor/SML-D12M1WT86/5843856; Component Type: Led; Component Category: Diode
IC200 IC201 = Nexperia, 74LVC4245A: IC, Buffer, TSSOP-24; ComponentLink1Description: Datasheet; ComponentLink1URL: E:\Altium\Datasheets\IC - Buffer\Nexperia, 74LVC4245A.pdf; ComponentLink2Description: Supplier Link; ComponentLink2URL: https://www.digikey.com/en/products/detail/nexperia-usa-inc/74LVC4245APW-118/1231659; Supplier: Digikey; Supplier Part Number: 1727-4308-1-ND; Manufacturer: Nexperia; Operating Temperature, Min: -40℃; Operating Temperature, Max: +125℃; Quantity, Min: 1; Quantity, Max: 5000; Price, Min: 0.34185; Supplier Currency: $; Price, Max: 0.91; Supplier Link: https://www.digikey.com/en/products/detail/nexperia-usa-inc/74LVC4245APW-118/1231659; Component Type: Buffer; Component Category: IC; Package: TSSOP-24
R200-R205 = Resistor: Res, 0R, M1005; Manufacturer: Yageo; Manufacturer Part Number: RC0402FR-070RL; Component Category: Resistor; Component Type: Fixed Value; Tolerance: *; Supplier Link: https://www.digikey.com/en/products/detail/yageo/RC0402FR-070RL/2827570; Supplier Currency: $; Price, Max: 0.00109; Price, Min: 0.1; Quantity, Max: 50000; Quantity, Min: 1; Operating Temperature, Max: -55℃; Operating Temperature, Min: +155℃; Supplier Part Number: 311-0.0LRCT-ND; Supplier: Digikey; ComponentLink1Description: Datasheet; ComponentLink1URL: E:\Altium\Datasheets\Resistor\Yageo - RC_L Series.pdf; ComponentLink2Description: Supplier Link; ComponentLink2URL: https://www.digikey.com/en/products/detail/yageo/RC0402FR-070RL/2827570

## Sheet Button.SchDoc
size A3; SheetNumber: 10; SheetTotal: 15
Used 3 times, as channels GPIO/Bt1, GPIO/Bt2, GPIO/Bt3. Parts and nets are listed once, with the designators drawn on the sheet.
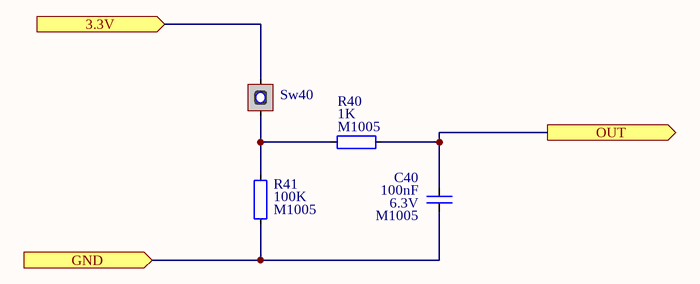
[diagram p10: Button.SchDoc]

### Parts
C40  value 100nF  Voltage: 6.3V  Package: M1005  [Capacitor_Ceramic_M1005_I0402]  (hidden comment: Capacitor_Ceramic)
R40  value 1K  Package: M1005  [Resistor_Smd_M1005_I0402]  (hidden comment: Resistor)
R41  value 100K  Package: M1005  [Resistor_Smd_M1005_I0402]  (hidden comment: Resistor)
Sw40  Tactile, SPST  [Tactile, SPST - Panasonic, EVQQ2]  (value not drawn)

### Ports
3.3V (in), GND (in), OUT (out)

### Nets
3.3V: Sw40.A ; port 3.3V
GND: C40.2 R41.2 ; port GND
OUT: C40.1 R40.2 ; port OUT
NetR40_1: R40.1 R41.1 Sw40.B

### Channels
GPIO/Bt1: designators end in _Bt1; ports 3.3V=3.3V GND=GND OUT=PE0
GPIO/Bt2: designators end in _Bt2; ports 3.3V=3.3V GND=GND OUT=PE1
GPIO/Bt3: designators end in _Bt3; ports 3.3V=3.3V GND=GND OUT=PE2

### Library data of the parts
C40 = Capacitor_Ceramic: as C200-C203 on sheet GPIO; ComponentLink1Description: Datasheet; ComponentLink1URL: E:\Altium\Datasheets\Capacitor\Kyocera - X5R.pdf; ComponentLink2Description: Supplier Link; ComponentLink2URL: https://www.digikey.com/en/products/detail/kyocera-avx/04026D104KAT4A/8107673; Supplier: Digikey; Supplier Part Number: 478-11504-1-ND; Operating Temperature, Min: +85℃; Operating Temperature, Max: -55℃; Quantity, Min: 1; Quantity, Max: 250000; Price, Min: 0.1; Supplier Currency: $; Price, Max: 0.00189; Supplier Link: https://www.digikey.com/en/products/detail/kyocera-avx/04026D104KAT4A/8107673; Component Type: Ceramic; Component Category: Capacitor
R40 = Resistor: Res, 1K, 1%, M1005; Manufacturer: Yageo; Manufacturer Part Number: RC0402FR-071KP; Component Category: Resistor; Component Type: Fixed Value; Tolerance: 1%; Supplier Link: https://www.digikey.com/en/products/detail/yageo/RC0402FR-071KP/4935269; Supplier Currency: $; Price, Max: 0.00282; Price, Min: 0.1; Quantity, Max: 100000; Quantity, Min: 1; Operating Temperature, Max: -55℃; Operating Temperature, Min: +155℃; Supplier Part Number: YAG1254CT-ND; Supplier: Digikey; ComponentLink1Description: Datasheet; ComponentLink1URL: E:\Altium\Datasheets\Resistor\Yageo - RC_L Series.pdf; ComponentLink2Description: Supplier Link; ComponentLink2URL: https://www.digikey.com/en/products/detail/yageo/RC0402FR-071KP/4935269
R41 = Resistor: Res, 100K, 1%, M1005; Manufacturer: Yageo; Manufacturer Part Number: RC0402FR-07100KP; Component Category: Resistor; Component Type: Fixed Value; Tolerance: 1%; Supplier Link: https://www.digikey.com/en/products/detail/yageo/RC0402FR-07100KP/12698883; Supplier Currency: $; Price, Max: 0.00282; Price, Min: 0.1; Quantity, Max: 100000; Quantity, Min: 1; Operating Temperature, Max: -55℃; Operating Temperature, Min: +155℃; Supplier Part Number: 13-RC0402FR-07100KPCT-ND; Supplier: Digikey; ComponentLink1Description: Datasheet; ComponentLink1URL: E:\Altium\Datasheets\Resistor\Yageo - RC_L Series.pdf; ComponentLink2Description: Supplier Link; ComponentLink2URL: https://www.digikey.com/en/products/detail/yageo/RC0402FR-07100KP/12698883
Sw40 = Tactile, SPST: *; Component Category: Switch; ComponentLink1Description: Datasheet; ComponentLink1URL: *; ComponentLink2Description: Supplier Link; ComponentLink2URL: *; Supplier: *; Supplier Part Number: *; Operating Temperature, Min: -*℃; Operating Temperature, Max: +*℃; Quantity, Min: *; Quantity, Max: *; Price, Min: *; Supplier Currency: *; Price, Max: *; Supplier Link: *; Component Type: Tactile; Manufacturer: *; Package: *; Manufacturer Part Number: *

## Sheet Switch.SchDoc
size A3; SheetNumber: 11; SheetTotal: 15
Used 3 times, as channels GPIO/Sw1, GPIO/Sw2, GPIO/Sw3. Parts and nets are listed once, with the designators drawn on the sheet.
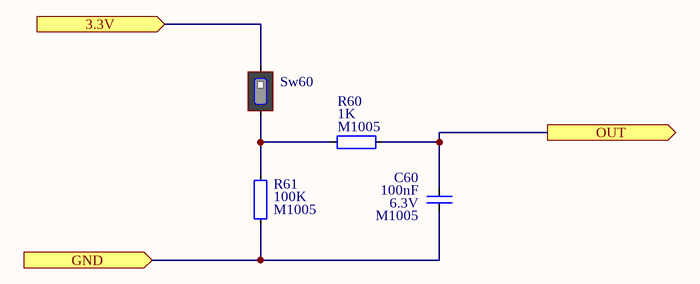
[diagram p11: Switch.SchDoc]

### Parts
C60  value 100nF  Voltage: 6.3V  Package: M1005  [Capacitor_Ceramic_M1005_I0402]  (hidden comment: Capacitor_Ceramic)
R60  value 1K  Package: M1005  [Resistor_Smd_M1005_I0402]  (hidden comment: Resistor)
R61  value 100K  Package: M1005  [Resistor_Smd_M1005_I0402]  (hidden comment: Resistor)
Sw60  Slide, SPST  [Slide, SPST - C&K, SDA01HxS]  (value not drawn)

### Ports
3.3V (in), GND (in), OUT (out)

### Nets
3.3V: Sw60.A ; port 3.3V
GND: C60.2 R61.2 ; port GND
OUT: C60.1 R60.2 ; port OUT
NetR60_1: R60.1 R61.1 Sw60.B

### Channels
GPIO/Sw1: designators end in _Sw1; ports 3.3V=3.3V GND=GND OUT=PD7
GPIO/Sw2: designators end in _Sw2; ports 3.3V=3.3V GND=GND OUT=PB8
GPIO/Sw3: designators end in _Sw3; ports 3.3V=3.3V GND=GND OUT=PB9

### Library data of the parts
C60 = Capacitor_Ceramic: as C200-C203 on sheet GPIO; ComponentLink1Description: Datasheet; ComponentLink1URL: E:\Altium\Datasheets\Capacitor\Kyocera - X5R.pdf; ComponentLink2Description: Supplier Link; ComponentLink2URL: https://www.digikey.com/en/products/detail/kyocera-avx/04026D104KAT4A/8107673; Supplier: Digikey; Supplier Part Number: 478-11504-1-ND; Operating Temperature, Min: +85℃; Operating Temperature, Max: -55℃; Quantity, Min: 1; Quantity, Max: 250000; Price, Min: 0.1; Supplier Currency: $; Price, Max: 0.00189; Supplier Link: https://www.digikey.com/en/products/detail/kyocera-avx/04026D104KAT4A/8107673; Component Type: Ceramic; Component Category: Capacitor
R60 = Resistor: as R40 on sheet Button; Component Category: Resistor; Component Type: Fixed Value; Tolerance: 1%; Supplier Link: https://www.digikey.com/en/products/detail/yageo/RC0402FR-071KP/4935269; Supplier Currency: $; Price, Max: 0.00282; Price, Min: 0.1; Quantity, Max: 100000; Quantity, Min: 1; Operating Temperature, Max: -55℃; Operating Temperature, Min: +155℃; Supplier Part Number: YAG1254CT-ND; Supplier: Digikey; ComponentLink1Description: Datasheet; ComponentLink1URL: E:\Altium\Datasheets\Resistor\Yageo - RC_L Series.pdf; ComponentLink2Description: Supplier Link; ComponentLink2URL: https://www.digikey.com/en/products/detail/yageo/RC0402FR-071KP/4935269
R61 = Resistor: as R41 on sheet Button; Component Category: Resistor; Component Type: Fixed Value; Tolerance: 1%; Supplier Link: https://www.digikey.com/en/products/detail/yageo/RC0402FR-07100KP/12698883; Supplier Currency: $; Price, Max: 0.00282; Price, Min: 0.1; Quantity, Max: 100000; Quantity, Min: 1; Operating Temperature, Max: -55℃; Operating Temperature, Min: +155℃; Supplier Part Number: 13-RC0402FR-07100KPCT-ND; Supplier: Digikey; ComponentLink1Description: Datasheet; ComponentLink1URL: E:\Altium\Datasheets\Resistor\Yageo - RC_L Series.pdf; ComponentLink2Description: Supplier Link; ComponentLink2URL: https://www.digikey.com/en/products/detail/yageo/RC0402FR-07100KP/12698883
Sw60 = Slide, SPST: *; Component Category: Switch; ComponentLink1Description: Datasheet; ComponentLink1URL: *; ComponentLink2Description: Supplier Link; ComponentLink2URL: *; Supplier: *; Supplier Part Number: *; Operating Temperature, Min: -*℃; Operating Temperature, Max: +*℃; Quantity, Min: *; Quantity, Max: *; Price, Min: *; Supplier Currency: *; Price, Max: *; Supplier Link: *; Component Type: Slide; Manufacturer: *; Package: *; Manufacturer Part Number: *

## Sheet Led Driver.SchDoc
size A3; SheetNumber: 12; SheetTotal: 15
Used 4 times, as channels GPIO/LdR, GPIO/LdO, GPIO/LdY, GPIO/LdG. Parts and nets are listed once, with the designators drawn on the sheet.
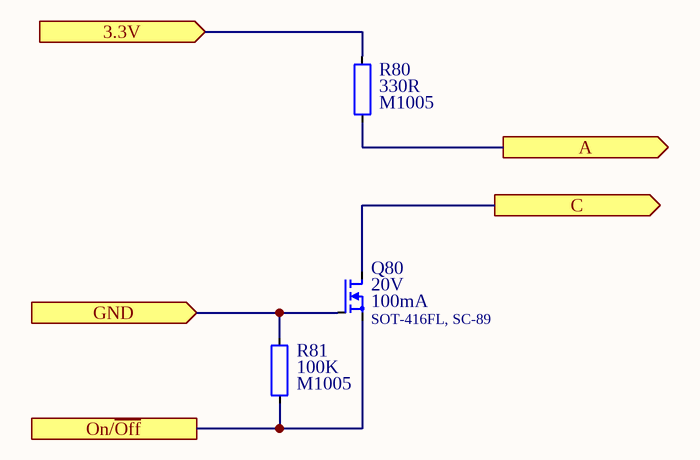
[diagram p12: Led Driver.SchDoc]

### Parts
Q80  Current: 100mA  Voltage: 20V  Package: SOT-416FL, SC-89  [SOT-416FL, Mosfet - Type 1]  (hidden comment: Mosfet, N-Channel)
R80  value 330R  Package: M1005  [Resistor_Smd_M1005_I0402]  (hidden comment: Resistor)
R81  value 100K  Package: M1005  [Resistor_Smd_M1005_I0402]  (hidden comment: Resistor)

### Ports
3.3V (in), A (out), C (out), GND (in), On/~{Off}

### Nets
3.3V: R80.1 ; port 3.3V
A: R80.2 ; port A
C: Q80.D ; port C
GND: Q80.G R81.1 ; port GND
On/~{Off}: Q80.S R81.2 ; port On/~{Off}

### Channels
GPIO/LdR: designators end in _LdR; ports 3.3V=3.3V A=A C=C GND=GND On/~{Off}=PE3
GPIO/LdO: designators end in _LdO; ports 3.3V=3.3V A=A C=C GND=GND On/~{Off}=PE4
GPIO/LdY: designators end in _LdY; ports 3.3V=3.3V A=A C=C GND=GND On/~{Off}=PE5
GPIO/LdG: designators end in _LdG; ports 3.3V=3.3V A=A C=C GND=GND On/~{Off}=PE6

### Library data of the parts
Q80 = Mosfet, N-Channel: MOSFET, N-CH, 20V, 100mA, SOT-416FL; Manufacturer Part Number: RE1C001UNTCL; Manufacturer: Rohm; Component Category: Transistor; ComponentLink1Description: Datasheet; ComponentLink1URL: E:\Altium\Datasheets\Transistor\Rohm, RE1C001UN.pdf; ComponentLink2Description: Supplier Link; ComponentLink2URL: https://www.digikey.com/en/products/detail/rohm-semiconductor/RE1C001UNTCL/4004557; Supplier: Digikey; Supplier Part Number: RE1C001UNTCLCT-ND; Operating Temperature, Min: *℃; Operating Temperature, Max: *℃; Quantity, Min: 1; Quantity, Max: 6000; Price, Min: 0.42; Price, Max: 0.0638; Supplier Currency: $; Supplier Link: https://www.digikey.com/en/products/detail/rohm-semiconductor/RE1C001UNTCL/4004557; Component Type: Mosfet
R80 = Resistor: Res, 330R, 1%, M1005; Manufacturer: Yageo; Manufacturer Part Number: RC0402FR-07330RL; Component Category: Resistor; Component Type: Fixed Value; Tolerance: 1%; Supplier Link: https://www.digikey.com/en/products/detail/yageo/RC0402FR-07330RL/726594; Supplier Currency: $; Price, Max: 0.00129; Price, Min: 0.1; Quantity, Max: 100000; Quantity, Min: 1; Operating Temperature, Max: -55℃; Operating Temperature, Min: +155℃; Supplier Part Number: 311-330LRCT-ND; Supplier: Digikey; ComponentLink1Description: Datasheet; ComponentLink1URL: E:\Altium\Datasheets\Resistor\Yageo - RC_L Series.pdf; ComponentLink2Description: Supplier Link; ComponentLink2URL: https://www.digikey.com/en/products/detail/yageo/RC0402FR-07330RL/726594
R81 = Resistor: as R41 on sheet Button; Component Category: Resistor; Component Type: Fixed Value; Tolerance: 1%; Supplier Link: https://www.digikey.com/en/products/detail/yageo/RC0402FR-07100KP/12698883; Supplier Currency: $; Price, Max: 0.00282; Price, Min: 0.1; Quantity, Max: 100000; Quantity, Min: 1; Operating Temperature, Max: -55℃; Operating Temperature, Min: +155℃; Supplier Part Number: 13-RC0402FR-07100KPCT-ND; Supplier: Digikey; ComponentLink1Description: Datasheet; ComponentLink1URL: E:\Altium\Datasheets\Resistor\Yageo - RC_L Series.pdf; ComponentLink2Description: Supplier Link; ComponentLink2URL: https://www.digikey.com/en/products/detail/yageo/RC0402FR-07100KP/12698883